# EAGLE design 4channelpot (EAGLE 9.1.2)
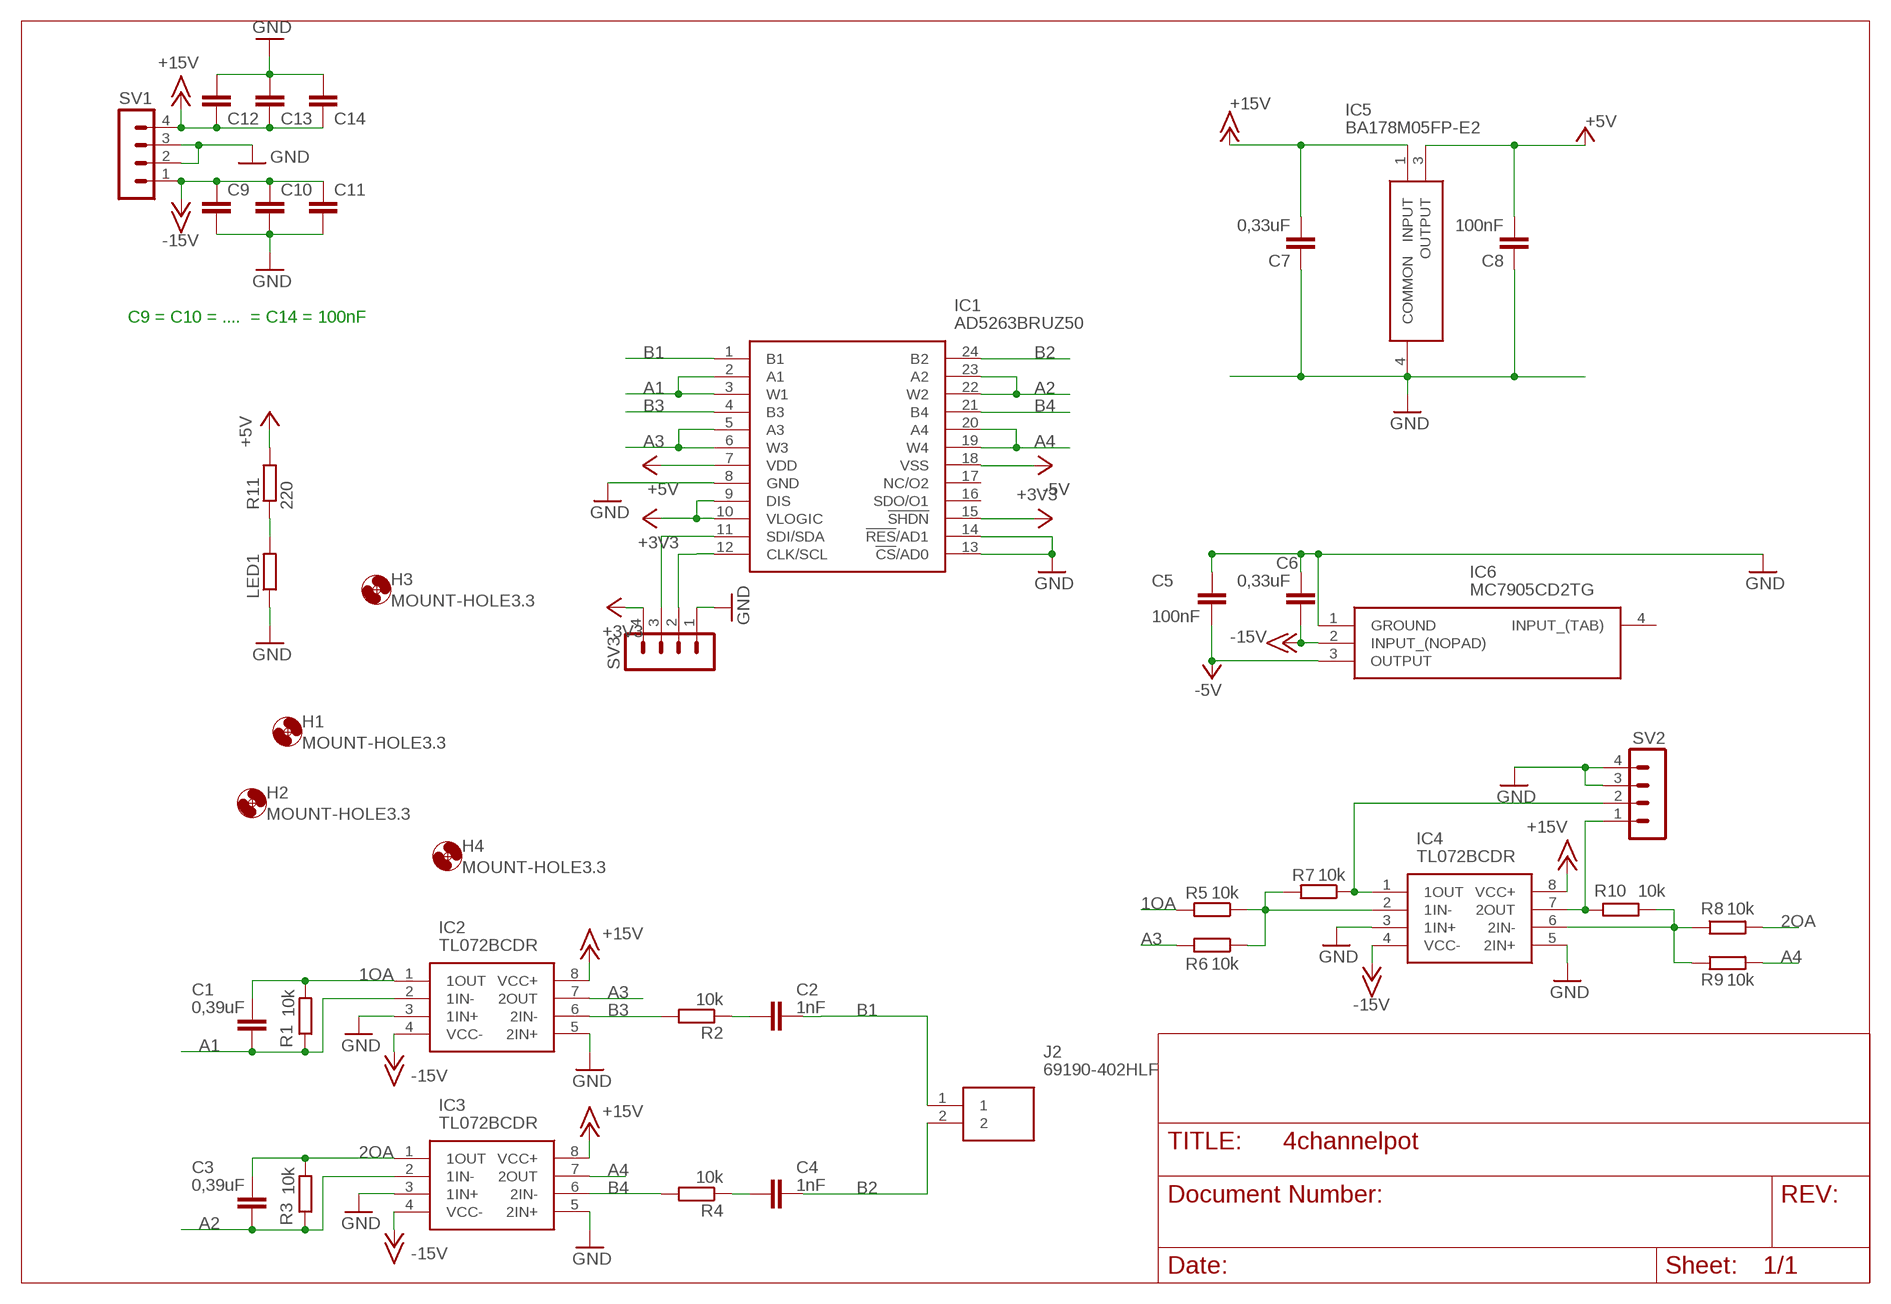
[diagram p0: schematic, sheet 1]

## Parts
C1  0,39uF  C-EUC0805  [C0805]
C2  1nF  C-EUC0805  [C0805]
C3  0,39uF  C-EUC0805  [C0805]
C4  1nF  C-EUC0805  [C0805]
C5  100nF  C-EUC0805  [C0805]
C6  0,33uF  C-EUC0805  [C0805]
C7  0,33uF  C-EUC0805  [C0805]
C8  100nF  C-EUC0805  [C0805]
C9  C-EUC0805  [C0805]
C10  C-EUC0805  [C0805]
C11  C-EUC0805  [C0805]
C12  C-EUC0805  [C0805]
C13  C-EUC0805  [C0805]
C14  C-EUC0805  [C0805]
H1  MOUNT-HOLE3.3  [3,3]
H2  MOUNT-HOLE3.3  [3,3]
H3  MOUNT-HOLE3.3  [3,3]
H4  MOUNT-HOLE3.3  [3,3]
IC1  AD5263BRUZ50  [SOP65P640X120-24N]
IC2  TL072BCDR  [SOIC127P600X175-8N]
IC3  TL072BCDR  [SOIC127P600X175-8N]
IC4  TL072BCDR  [SOIC127P600X175-8N]
IC5  BA178M05FP-E2  [BD750L5FPCE2]
IC6  MC7905CD2TG  [TO254P1420X457-4N]
J2  69190-402HLF  [HDRV2W90P0X254_1X2_508X241X858]
LED1  R-EU_R0805  [R0805]
R1  10k  R-EU_R0805  [R0805]
R2  10k  R-EU_R0805  [R0805]
R3  10k  R-EU_R0805  [R0805]
R4  10k  R-EU_R0805  [R0805]
R5  10k  R-EU_R0805  [R0805]
R6  10k  R-EU_R0805  [R0805]
R7  10k  R-EU_R0805  [R0805]
R8  10k  R-EU_R0805  [R0805]
R9  10k  R-EU_R0805  [R0805]
R10  10k  R-EU_R0805  [R0805]
R11  220  R-EU_R0805  [R0805]
SV1  MA04-1  [MA04-1]
SV2  MA04-1  [MA04-1]
SV3  MA04-1  [MA04-1]

## Nets
1OA: C1.1 IC2.1(1OUT) R1.2 R5.2
2OA: C3.1 IC3.1(1OUT) R3.2 R8.2
+3V3: IC1.9(DIS) IC1.10(VLOGIC) IC1.15(!SHDN) SV3.4
+5V: C8.2 IC1.7(VDD) IC5.3(OUTPUT) R11.2
+15V: C7.2 C12.1 C13.1 C14.1 IC2.8(VCC+) IC3.8(VCC+) IC4.8(VCC+) IC5.1(INPUT) SV1.4
-5V: C5.2 IC1.18(VSS) IC6.3(OUTPUT)
-15V: C6.2 C9.1 C10.1 C11.1 IC2.4(VCC-) IC3.4(VCC-) IC4.4(VCC-) IC6.2(INPUT_(NOPAD)) SV1.1
A1: C1.2 IC1.2(A1) IC1.3(W1) IC2.2(1IN-) R1.1
A2: C3.2 IC1.22(W2) IC1.23(A2) IC3.2(1IN-) R3.1
A3: IC1.5(A3) IC1.6(W3) IC2.7(2OUT) R6.2
A4: IC1.19(W4) IC1.20(A4) IC3.7(2OUT) R9.2
B1: C2.1 IC1.1(B1) J2.1
B2: C4.1 IC1.24(B2) J2.2
B3: IC1.4(B3) IC2.6(2IN-) R2.2
B4: IC1.21(B4) IC3.6(2IN-) R4.2
GND: C5.1 C6.1 C7.1 C8.1 C9.2 C10.2 C11.2 C12.2 C13.2 C14.2 IC1.8(GND) IC1.13(!CS!/AD0) IC1.14(!RES!/AD1) IC2.3(1IN+) IC2.5(2IN+) IC3.3(1IN+) IC3.5(2IN+) IC4.3(1IN+) IC4.5(2IN+) IC5.4(COMMON) IC6.1(GROUND) LED1.1 SV1.2 SV1.3 SV2.3 SV2.4 SV3.1
N$1: IC4.2(1IN-) R5.1 R6.1 R7.2
N$2: IC4.1(1OUT) R7.1 SV2.2
N$3: LED1.2 R11.1
N$4: C2.2 R2.1
N$7: IC4.6(2IN-) R8.1 R9.1 R10.2
N$8: IC1.11(SDI/SDA) SV3.3
N$9: IC1.12(CLK/SCL) SV3.2
N$10: C4.2 R4.1
N$12: IC4.7(2OUT) R10.1 SV2.1
Unconnected: IC1.16(SDO/O1) IC1.17(NC/O2) IC6.4(INPUT_(TAB))

## Notes on the sheet
- C9 = C10 = ....  = C14 = 100nF

## Library data of the parts
C1-C14 = rcl-vito:C-EU: CAPACITOR, European symbol
H1-H4 = holes:MOUNT-HOLE: MOUNTING HOLE with drill center marker
IC1 = AD5263BRUZ50:AD5263BRUZ50: AD5263BRU50 256-step quad pot, 50K Source: Datasheet <http://www.analog.com/static/imported-files/data_sheets/AD5263.pdf>; DESCRIPTION: AD5263BRU50 256-step quad pot, 50K; HEIGHT: 1.2mm; MANUFACTURER_NAME: Analog Devices; MANUFACTURER_PART_NUMBER: AD5263BRUZ50; MOUSER_PART_NUMBER: 584-AD5263BRUZ50; MOUSER_PRICE-STOCK: https://www.mouser.co.uk/ProductDetail/Analog-Devices/AD5263BRUZ50?qs=NmRFExCfTkGP%252BMexGahavw%3D%3D
IC2-IC4 = TL072BCDR:TL072BCDR: Dual low-noise JFET-input low offset operational amplifier Source: Datasheet <http://www.ti.com/lit/gpn/tl072b>; DESCRIPTION: Dual low-noise JFET-input low offset operational amplifier; HEIGHT: 1.75mm; MANUFACTURER_NAME: Texas Instruments; MANUFACTURER_PART_NUMBER: TL072BCDR; MOUSER_PART_NUMBER: 595-TL072BCDR; MOUSER_PRICE-STOCK: https://www.mouser.co.uk/ProductDetail/Texas-Instruments/TL072BCDR?qs=odmYgEirbwyOLHKvwmd6sw%3D%3D
IC5 = BA178M05FP-E2:BA178M05FP-E2: 500mA Output 78 series Regulators Surface mount type: ROHM's broad lineup of 78 series regulators is available in 11 output voltages (5V, 6V, 7V, 8V, 9V, 10V, 12V, 15V, 18V, 20V, and 24V), 2 current types, and different package configurations, making them ideal for a wide variety of applications. Pin-compatible models are also available for greater compatibility. In addition, multiple protection circuits are integrated (i.e. overcurrent, overvoltage), ensuring a high degree of reliability under any environm Source: Datasheet <https://componentsearchengine.com/Datasheets/2/BA178M05FP-E2.pdf>; DESCRIPTION: 500mA Output 78 series Regulators Surface mount type: ROHM's broad lineup of 78 series regulators is available in 11 output voltages (5V, 6V, 7V, 8V, 9V, 10V, 12V, 15V, 18V, 20V, and 24V), 2 current types, and different package configurations, making them ideal for a wide variety of applications. Pin-compatible models are also available for greater compatibility. In addition, multiple protection circuits are integrated (i.e. overcurrent, overvoltage), ensuring a high degree of reliability under any environm; HEIGHT: mm; MANUFACTURER_NAME: ROHM Semiconductor; MANUFACTURER_PART_NUMBER: BA178M05FP-E2; MOUSER_PART_NUMBER: 755-BA178M05FP-E2; MOUSER_PRICE-STOCK: https://www.mouser.co.uk/ProductDetail/ROHM-Semiconductor/BA178M05FP-E2?qs=4kLU8WoGk0v8xv6raA1afQ%3D%3D
IC6 = MC7905CD2TG:MC7905CD2TG: Source: Datasheet <http://www.onsemi.com/pub/Collateral/MC7900-D.PDF>; HEIGHT: 4.572mm; MANUFACTURER_NAME: ON Semiconductor; MANUFACTURER_PART_NUMBER: MC7905CD2TG; MOUSER_PART_NUMBER: 863-MC7905CD2TG; MOUSER_PRICE-STOCK: https://www.mouser.co.uk/ProductDetail/ON-Semiconductor/MC7905CD2TG?qs=%252B9%2Fcbd0IE0Q0zRAvbRM7CA%3D%3D
J2 = 69190-402HLF:69190-402HLF: FCI,Header 2 way unshrouded FCI, Series Number 69190, 2.54mm Pitch 2 Way 1 Row Straight Header, Solder Termination Source: Datasheet <https://cdn.amphenol-icc.com/media/wysiwyg/files/drawing/69190.pdf>; ALLIED_NUMBER: 70302517; ALLIED_PRICE-STOCK: https://www.alliedelec.com/amphenol-fci-69190-402hlf/70302517/; ARROW_PART_NUMBER: 69190-402HLF; ARROW_PRICE-STOCK: https://www.arrow.com/en/products/69190-402hlf/amphenol-fci; DESCRIPTION: FCI,Header 2 way unshrouded FCI, Series Number 69190, 2.54mm Pitch 2 Way 1 Row Straight Header, Solder Termination; HEIGHT: 8.58mm; MANUFACTURER_NAME: FCI; MANUFACTURER_PART_NUMBER: 69190-402HLF; RS_PART_NUMBER: 8632731; RS_PRICE-STOCK: http://uk.rs-online.com/web/p/products/8632731
LED1 R1-R11 = rcl-vito:R-EU_: RESISTOR, European symbol
SV1-SV3 = con-lstb:MA04-1: PIN HEADER; OC_FARNELL: unknown; OC_NEWARK: unknown

## Board
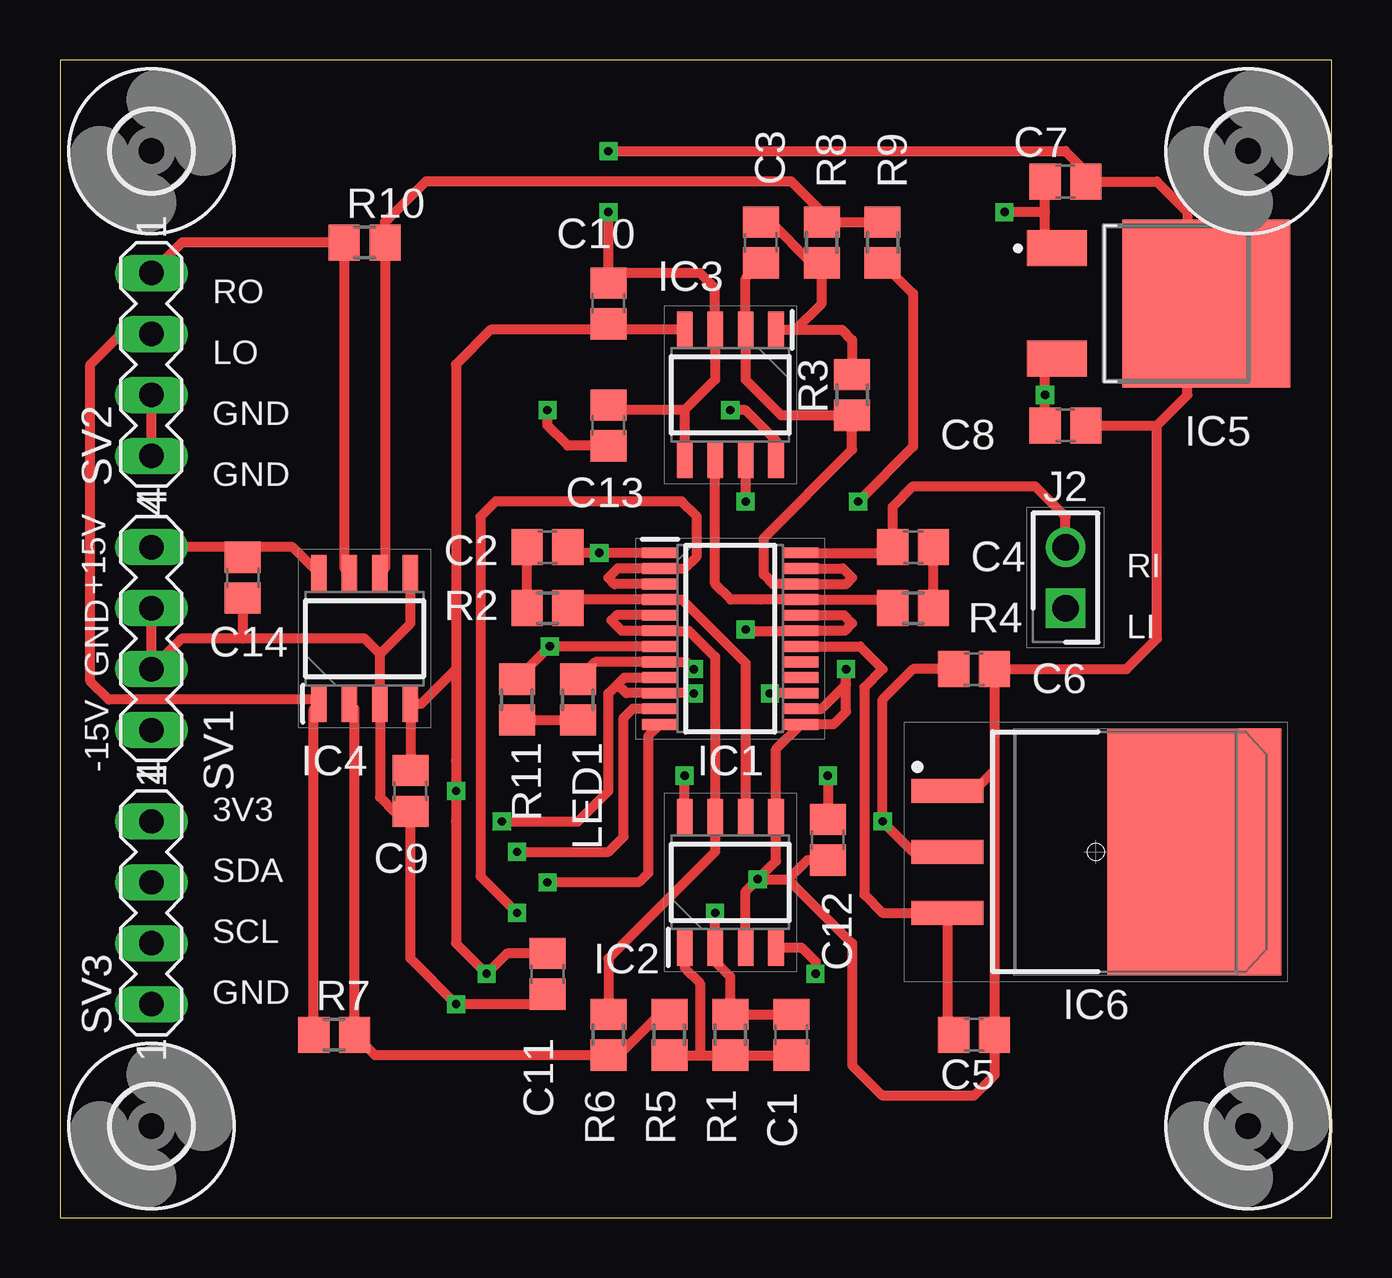
[diagram p1: board, top side]
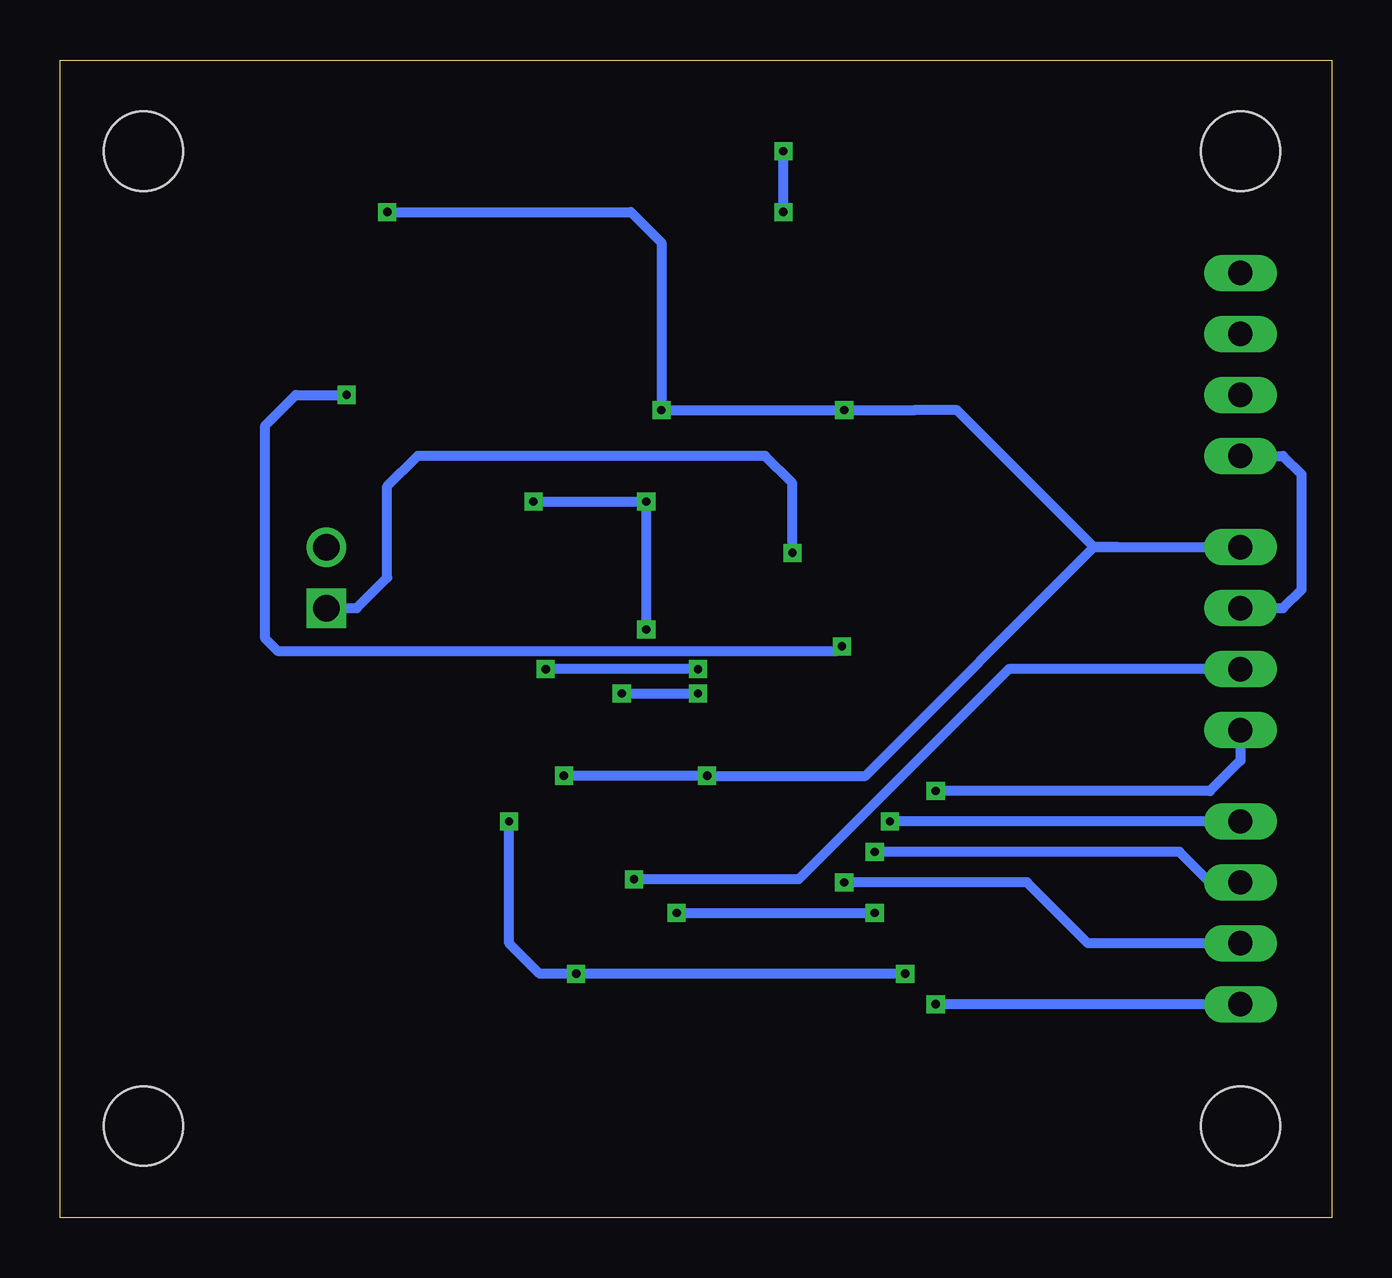
[diagram p2: board, bottom side, seen from below]

Size 53.01 x 48.25 mm. Coordinates in mm from the lower left corner, seen from the top.
Outline: 0,0 53.01,0 53.01,48.25 0,48.25 0,0
Copper layers (1*16): Top 0.035mm / dielectric 1.5mm / Bottom 0.035mm
Design rules "default": minimum track width 6mil, minimum drill 0.35mm, track to track 6mil, track to pad 6mil, pad to pad 6mil, via to via 6mil, smd to smd 6mil, copper to edge 40mil, drill to drill 6mil, minimum pad ring 10mil, minimum via ring 8mil, stop-mask expansion 4mil, vias tented up to drill 0mil, thermal gap 10mil

### Footprints (pad centres in the part's own frame; a part is rotated, then mirrored left to right if it is on the bottom)
C0805 = smd 1.3 x 1.5: 1 -0.85,0; 2 0.85,0
3,3 = hole 3.3: 0,0
SOP65P640X120-24N = smd 1.475 x 0.45: 1 -2.938,3.575; 2 -2.938,2.925; 3 -2.938,2.275; 4 -2.938,1.625; 5 -2.938,0.975; 6 -2.938,0.325; 7 -2.938,-0.325; 8 -2.938,-0.975; 9 -2.938,-1.625; 10 -2.938,-2.275; 11 -2.938,-2.925; 12 -2.938,-3.575; 13 2.938,-3.575; 14 2.938,-2.925; 15 2.938,-2.275; 16 2.938,-1.625; 17 2.938,-0.975; 18 2.938,-0.325; 19 2.938,0.325; 20 2.938,0.975; 21 2.938,1.625; 22 2.938,2.275; 23 2.938,2.925; 24 2.938,3.575
SOIC127P600X175-8N = smd 1.528 x 0.65: 1 -2.711,1.905; 2 -2.711,0.635; 3 -2.711,-0.635; 4 -2.711,-1.905; 5 2.711,-1.905; 6 2.711,-0.635; 7 2.711,0.635; 8 2.711,1.905
BD750L5FPCE2 = smd 1.5 x 2.5: 1 -2.3,-7.98; 3 2.3,-7.98 | smd 7 x 7: 4 0,-1.75
TO254P1420X457-4N = smd 3 x 1: 1 -6.2,2.54; 2 -6.2,0; 3 -6.2,-2.54 | smd 7.25 x 10.3: 4 4.1,0
HDRV2W90P0X254_1X2_508X241X858 = drill 1.1 pad 1.65 square: 1 0,0 | drill 1.1 pad 1.65: 2 2.54,0
R0805 = smd 1.3 x 1.5: 1 -0.85,0; 2 0.85,0
MA04-1 = drill 1.016 long: 1 -3.81,0; 2 -1.27,0; 3 1.27,0; 4 3.81,0

### Placement (x,y rotation side)
C1  30.48,7.62 90 top
C2  20.32,27.94 180 top
C3  29.21,40.64 270 top
C4  35.56,27.94 0 top
C5  38.1,7.62 180 top
C6  38.1,22.86 180 top
C7  41.91,43.18 180 top
C8  41.91,33.02 180 top
C9  14.61,17.78 270 top
C10  22.86,38.1 90 top
C11  20.32,10.16 270 top
C12  32,15.75 270 top
C13  22.86,33.02 90 top
C14  7.62,26.67 270 top
H1  3.81,3.81 0 top
H2  3.81,44.45 0 top
H3  49.53,3.81 0 top
H4  49.53,44.45 0 top
IC1  27.94,24.13 0 top
IC2  27.94,13.97 90 top
IC3  27.94,34.29 270 top
IC4  12.7,24.13 90 top
IC5  49.53,38.1 270 top
IC6  43.18,15.24 0 top
J2  41.91,25.4 90 top
LED1  21.59,21.59 270 top
R1  27.94,7.62 270 top
R2  20.32,25.4 0 top
R3  33.02,34.29 90 top
R4  35.56,25.4 180 top
R5  25.4,7.62 270 top
R6  22.86,7.62 90 top
R7  11.43,7.62 0 top
R8  31.75,40.64 270 top
R9  34.29,40.64 270 top
R10  12.7,40.64 0 top
R11  19.05,21.59 90 top
SV1  3.81,24.13 90 top
SV2  3.81,35.56 270 top
SV3  3.81,12.7 90 top

### Tracks (layer width: path | path; a pad name or v marks a point on that pad's centre or on a via)
1OA
  Top 0.406: R5.2 26.67,6.77 | 26.67,6.77 R1.2 C1.1 | IC2.1 26.04,10.41 26.67,9.78 26.67,6.77
2OA
  Top 0.406: C3.1 29.63,41.49 31.33,39.79 R8.2 31.75,38.1 30.65,37 30.48,37 | IC3.1 30.48,37 | 30.48,37 32.59,37 33.02,36.58 R3.2
+3V3  (via drill 0.35)
  Top 0.406: 23.24,22.22 23.61,21.86 IC1.10 26.4,21.86 v26.42,21.84 | 23.24,22.22 23.52,22.5 IC1.9 | IC1.15 29.6,21.86 v29.59,21.84 | v18.42,16.51 21.59,16.51 22.86,17.78 22.86,21.84 23.24,22.22
  Bottom 0.406: v29.59,21.84 v26.42,21.84 | SV3.4 v18.42,16.51
+5V  (via drill 0.35)
  Top 0.406: C8.2 v41.06,34.29 41.06,35.14 40.64,35.56 40.88,35.8 IC5.3 | IC1.7 v20.42,23.81 R11.2
  Bottom 0.406: v41.06,34.29 43.18,34.29 44.45,33.02 44.45,24.13 43.94,23.62 20.6,23.62 v20.42,23.81
+15V  (via drill 0.35)
  Top 0.406: IC5.1 41.06,40.89 41.06,41.91 | 41.06,41.91 C7.2 | IC4.8 9.7,27.94 7.62,27.94 | 7.62,27.94 SV1.4 | IC3.8 29.85,32.39 28.57,33.66 v27.94,33.66 | IC2.8 v26.04,18.41 | 41.06,41.91 v39.37,41.91 | C14.1 7.62,27.94 | v32,18.41 C12.1 | C13.1 21.17,32.17 20.32,33.02 v20.32,33.66
  Bottom 0.406: SV1.4 6.35,27.94 8.89,27.94 | 9.91,27.94 8.89,27.94 | 9.91,27.94 19.43,18.41 v26.04,18.41 v32,18.41 | 8.89,27.94 9.91,27.94 | 9.91,27.94 15.62,33.66 17.4,33.66 v20.32,33.66 v27.94,33.66 27.94,40.64 29.21,41.91 v39.37,41.91
-5V
  Top 0.406: C5.2 36.98,7.89 IC6.3 34.29,12.7 33.53,13.46 33.53,22.1 34.29,22.86 33.34,23.81 IC1.18
-15V  (via drill 0.35)
  Top 0.406: C6.2 35.56,22.86 34.29,21.59 v34.29,16.51 35.56,15.24 IC6.2 | 16.51,22.86 15.07,21.42 IC4.4 C9.1 | IC3.4 22.86,37 | 22.86,37 17.95,37 16.51,35.56 16.51,22.86 | 16.51,22.86 16.51,19.05 v16.51,17.78 16.51,16.51 16.51,11.43 v17.78,10.16 18.63,11.01 C11.1 | IC2.4 30.9,11.26 31.5,10.67 v31.5,10.16 | C10.1 22.86,37
  Bottom 0.406: v17.78,10.16 v31.5,10.16 33.02,10.16 34.29,11.43 v34.29,16.51 | SV1.1 3.81,19.05 5.08,17.78 v16.51,17.78
A1  (via drill 0.35)
  Top 0.406: IC1.3 23.12,26.4 22.86,26.67 23.25,27.06 IC1.2 26.04,27.06 26.54,27.56 26.54,29.21 25.91,29.85 18.16,29.85 17.53,29.21 17.53,14.22 v19.05,12.7 | C1.2 R1.1 27.94,10.03 27.3,10.67 IC2.2 v27.3,12.7
  Bottom 0.406: v27.3,12.7 v19.05,12.7
A2
  Top 0.406: IC1.23 32.64,27.06 33.02,26.67 32.75,26.4 IC1.22 29.73,26.4 29.34,26.8 29.34,28.32 33.02,32 R3.1 30.06,33.44 28.57,34.92 IC3.2 28.57,39.16 C3.2
A3
  Top 0.406: IC1.5 23.2,25.11 23.18,25.08 22.99,24.89 23.42,24.46 IC1.6 26.22,24.46 27.3,23.37 IC2.7 27.3,15.24 22.86,10.8 R6.2
A4  (via drill 0.35)
  Top 0.406: IC1.20 32.68,25.11 33.02,24.77 32.71,24.46 IC1.19 28.63,24.46 v28.57,24.51 | IC3.7 v28.57,29.85 | R9.2 35.56,38.52 35.56,32.13 v33.27,29.85
  Bottom 0.406: v28.57,24.51 v28.57,29.85 v33.27,29.85
B1  (via drill 0.35)
  Top 0.406: C2.1 21.4,27.71 v22.48,27.71 IC1.1
  Bottom 0.406: J2.1 40.64,25.4 39.37,26.67 39.37,30.48 38.1,31.75 23.62,31.75 22.48,30.61 v22.48,27.71
B2
  Top 0.406: IC1.24 34.47,27.71 C4.1 34.71,29.63 35.56,30.48 40.64,30.48 41.91,29.21 J2.2
B3
  Top 0.406: R2.2 21.53,25.75 IC1.4 25.4,25.75 25.93,25.75 28.57,23.11 IC2.6
B4
  Top 0.406: R4.2 34.35,25.75 IC1.21 29.21,25.75 27.97,25.75 27.3,26.42 IC3.6
GND  (via drill 0.35)
  Top 0.406: 38.95,19.05 38.95,21.59 C6.1 44.45,22.86 45.72,24.13 45.72,33.02 | 38.95,19.05 38.95,18.63 38.1,17.78 IC6.1 | 38.95,19.05 C5.1 38.95,5.93 38.1,5.08 34.29,5.08 33.02,6.35 33.02,11.43 30.35,14.1 | C8.1 45.72,33.02 | 45.72,33.02 46.99,34.29 46.99,38.1 | 46.99,38.1 IC5.4 | C7.1 43.18,43.18 | 43.18,43.18 45.72,43.18 46.99,41.91 46.99,38.1 | IC2.3 28.57,13.59 v29.08,14.1 | v29.08,14.1 29.85,14.86 IC2.5 29.85,19.52 IC1.13 32.24,20.56 32.64,20.96 32.77,21.08 32.77,22.61 | LED1.1 22.3,23.15 IC1.8 26.12,23.15 v26.42,22.86 | 13.33,22.86 IC4.3 13.33,17.53 13.93,16.93 C9.2 14.61,10.8 v16.51,8.89 20.32,8.89 C11.2 | 13.33,22.86 13.33,23.5 | IC4.5 14.61,24.77 13.33,23.5 | SV1.3 3.81,24.13 SV1.2 5.08,24.13 7.62,24.13 | SV2.3 SV2.4 | 13.33,22.86 13.33,23.5 | 13.33,23.5 12.7,24.13 7.62,24.13 | 26.04,33.66 26.04,33.02 IC3.5 | 26.04,33.66 27.3,34.92 IC3.3 27.3,38.73 26.67,39.37 23.28,39.37 C10.2 v22.86,41.91 | 32.77,22.61 v32.77,22.86 | IC1.14 31.75,21.21 32.77,22.22 32.77,22.61 | v29.08,14.1 30.35,14.1 | C14.2 7.62,24.13 | 30.35,14.1 31.15,14.9 C12.2 | 26.04,33.66 23.07,33.66 C13.2 | v22.86,44.45 41.91,44.45 43.18,43.18
  Bottom 0.406: SV1.3 2.03,25.4 1.27,26.16 1.27,30.99 2.03,31.75 SV2.4 | v26.42,22.86 v32.77,22.86 | v29.08,14.1 22.22,14.1 13.46,22.86 SV1.2 | v22.86,41.91 v22.86,44.45 | SV3.1 v16.51,8.89
N$1
  Top 0.406: R5.1 24.98,8.47 23.28,6.77 R6.1 13.13,6.77 R7.2 12.28,21.2 IC4.2
N$2
  Top 0.406: R7.1 10.58,21.2 IC4.1 10.62,21.59 2.03,21.59 1.27,22.35 1.27,35.56 2.54,36.83 SV2.2
N$3
  Top 0.406: R11.1 LED1.2
N$4
  Top 0.406: R2.1 C2.2
N$7
  Top 0.406: R9.1 R8.1 31.75,41.91 30.48,43.18 15.24,43.18 13.55,41.49 R10.2 13.55,27.06 IC4.6
N$8  (via drill 0.35)
  Top 0.406: IC1.11 23.87,21.21 23.5,20.83 23.5,15.88 22.86,15.24 v19.05,15.24
  Bottom 0.406: SV3.3 5.08,13.97 6.35,15.24 v19.05,15.24
N$9  (via drill 0.35)
  Top 0.406: IC1.12 24.51,20.06 24.51,14.35 24.13,13.97 v20.32,13.97
  Bottom 0.406: v20.32,13.97 12.7,13.97 10.16,11.43 SV3.2
N$10
  Top 0.406: R4.1 C4.2
N$12
  Top 0.406: IC4.7 11.85,27.06 R10.1 5.08,40.64 SV2.1

### Text on the board
tNames: RO | LO | GND | GND | +15V | RI | GND | LI | -15V | 3V3 | SDA | SCL | GND